# Altium schematic sheet LED.SchDoc
size A
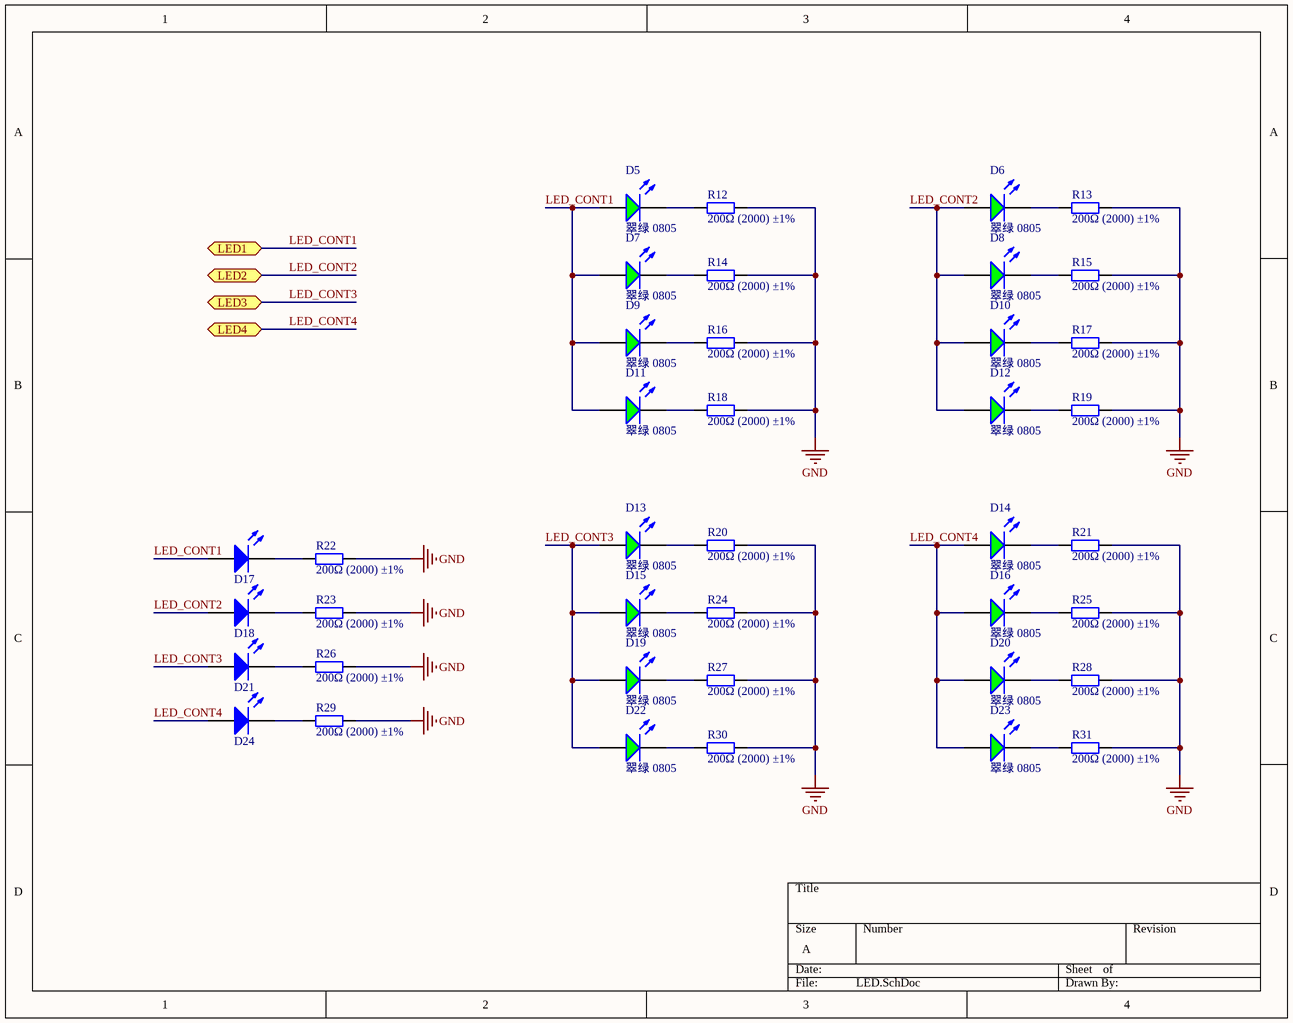
[diagram p0: LED.SchDoc]

## Parts
D5  翠绿 0805  [LC-0805_LED_S1]
D6  翠绿 0805  [LC-0805_LED_S1]
D7  翠绿 0805  [LC-0805_LED_S1]
D8  翠绿 0805  [LC-0805_LED_S1]
D9  翠绿 0805  [LC-0805_LED_S1]
D10  翠绿 0805  [LC-0805_LED_S1]
D11  翠绿 0805  [LC-0805_LED_S1]
D12  翠绿 0805  [LC-0805_LED_S1]
D13  翠绿 0805  [LC-0805_LED_S1]
D14  翠绿 0805  [LC-0805_LED_S1]
D15  翠绿 0805  [LC-0805_LED_S1]
D16  翠绿 0805  [LC-0805_LED_S1]
D17  LED0  [LED_A2]  (value not drawn)
D18  LED0  [LED_A2]  (value not drawn)
D19  翠绿 0805  [LC-0805_LED_S1]
D20  翠绿 0805  [LC-0805_LED_S1]
D21  LED0  [LED_A2]  (value not drawn)
D22  翠绿 0805  [LC-0805_LED_S1]
D23  翠绿 0805  [LC-0805_LED_S1]
D24  LED0  [LED_A2]  (value not drawn)
R12  200Ω (2000) ±1%  [LC-0805_R]
R13  200Ω (2000) ±1%  [LC-0805_R]
R14  200Ω (2000) ±1%  [LC-0805_R]
R15  200Ω (2000) ±1%  [LC-0805_R]
R16  200Ω (2000) ±1%  [LC-0805_R]
R17  200Ω (2000) ±1%  [LC-0805_R]
R18  200Ω (2000) ±1%  [LC-0805_R]
R19  200Ω (2000) ±1%  [LC-0805_R]
R20  200Ω (2000) ±1%  [LC-0805_R]
R21  200Ω (2000) ±1%  [LC-0805_R]
R22  200Ω (2000) ±1%  [LC-0805_R]
R23  200Ω (2000) ±1%  [LC-0805_R]
R24  200Ω (2000) ±1%  [LC-0805_R]
R25  200Ω (2000) ±1%  [LC-0805_R]
R26  200Ω (2000) ±1%  [LC-0805_R]
R27  200Ω (2000) ±1%  [LC-0805_R]
R28  200Ω (2000) ±1%  [LC-0805_R]
R29  200Ω (2000) ±1%  [LC-0805_R]
R30  200Ω (2000) ±1%  [LC-0805_R]
R31  200Ω (2000) ±1%  [LC-0805_R]

## Ports
LED1, LED2, LED3, LED4

## Nets
GND: R12.2 R13.2 R14.2 R15.2 R16.2 R17.2 R18.2 R19.2 R20.2 R21.2 R22.2 R23.2 R24.2 R25.2 R26.2 R27.2 R28.2 R29.2 R30.2 R31.2
LED_CONT1: D5.A D7.A D9.A D11.A D17.1(A) ; port LED1
LED_CONT2: D6.A D8.A D10.A D12.A D18.1(A) ; port LED2
LED_CONT3: D13.A D15.A D19.A D21.1(A) D22.A ; port LED3
LED_CONT4: D14.A D16.A D20.A D23.A D24.1(A) ; port LED4
NetD5_K: D5.K R12.1
NetD6_K: D6.K R13.1
NetD7_K: D7.K R14.1
NetD8_K: D8.K R15.1
NetD9_K: D9.K R16.1
NetD10_K: D10.K R17.1
NetD11_K: D11.K R18.1
NetD12_K: D12.K R19.1
NetD13_K: D13.K R20.1
NetD14_K: D14.K R21.1
NetD15_K: D15.K R24.1
NetD16_K: D16.K R25.1
NetD17_2: D17.2(K) R22.1
NetD18_2: D18.2(K) R23.1
NetD19_K: D19.K R27.1
NetD20_K: D20.K R28.1
NetD21_2: D21.2(K) R26.1
NetD22_K: D22.K R30.1
NetD23_K: D23.K R31.1
NetD24_2: D24.2(K) R29.1

## Library data of the parts
D5-D16 D19 D20 D22 D23 = 0805 翠绿: 发光二极管; ComponentLink1Description: 供应商链接; ComponentLink1URL: http://www.szlcsc.com/product/details_2670.html; Package: 0805; Supplier: LC; SuppliersPartNumber: C2297
D17 D18 D21 D24 = LED0: 发光二极管; Published: 8-Jun-2000; LatestRevisionDate: 08-Jul-2005; LatestRevisionNote: Mech Layer 1 removed.; PackageReference: LED-0; Publisher: Altium Limited
R12-R31 = 0805 200Ω (2000) 1%: 贴片电阻; ComponentLink1Description: 供应商链接; ComponentLink1URL: http://www.szlcsc.com/product/details_18228.html; Package: 0805; Supplier: LC; SuppliersPartNumber: C17540